# Altium schematic sheet MCU MKL05 QFN24.SchDoc
size A
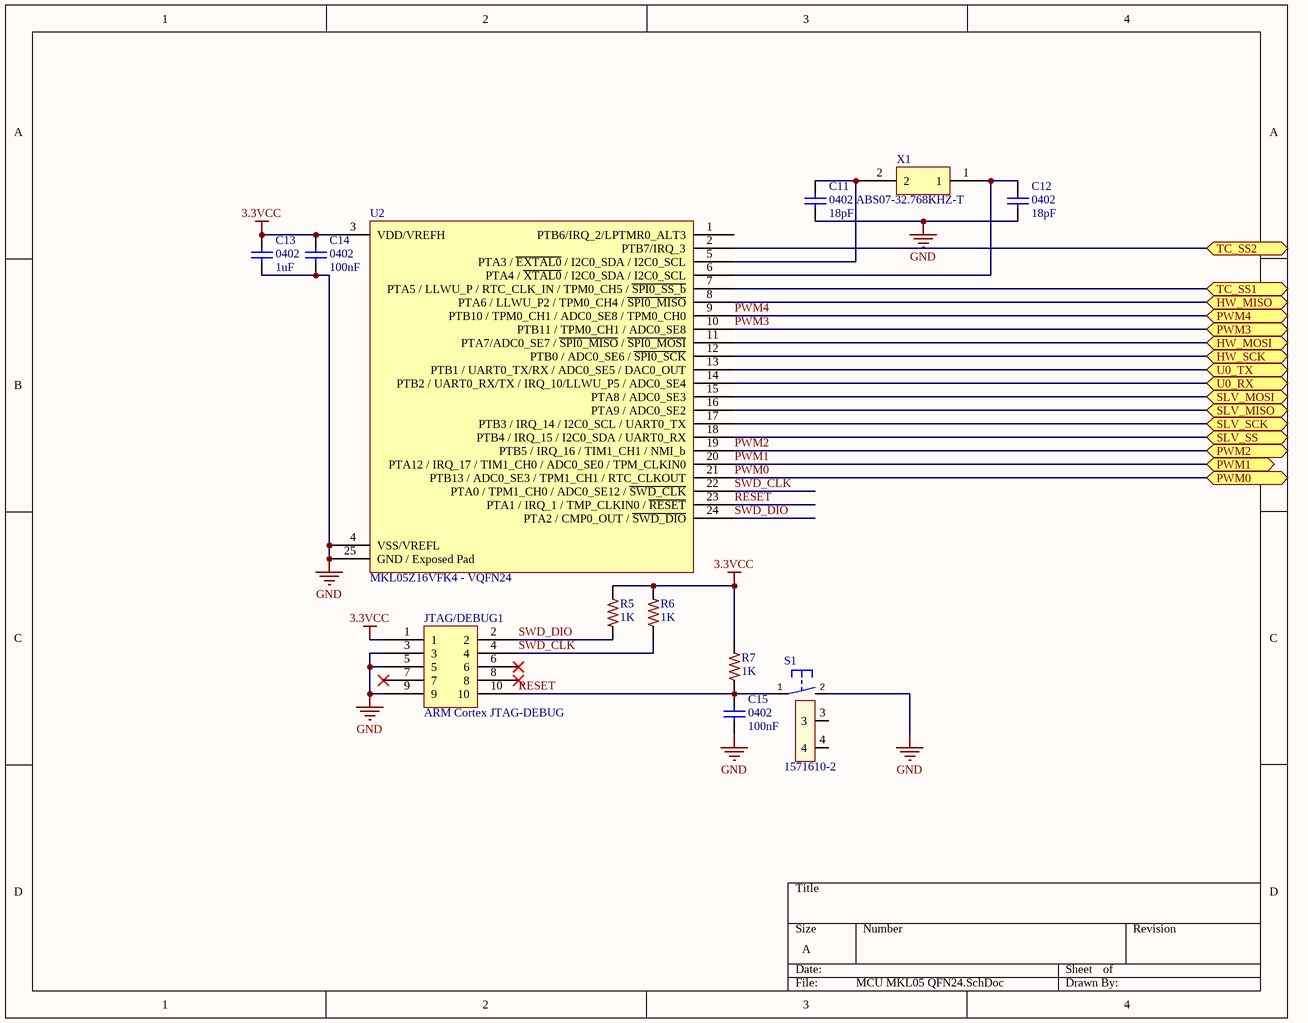
[diagram p0: MCU MKL05 QFN24.SchDoc]

## Parts
C11  value 18pF  [C0402]  (hidden comment: 0402)
C12  value 18pF  [C0402]  (hidden comment: 0402)
C13  value 1uF  [C0402]  (hidden comment: 0402)
C14  value 100nF  [C0402]  (hidden comment: 0402)
C15  value 100nF  [C0402]  (hidden comment: 0402)
JTAG/DEBUG1  ARM Cortex JTAG-DEBUG  [FTSH-105-XX-X-DV]
R5  1K  [R0603]
R6  1K  [R0603]
R7  1K  [R0603]
S1  1571610-2  [B3F-31XX]
U2  MKL05Z16VFK4 - VQFN24  [98ASA00474D]
X1  ABS07-32.768KHZ-T  [ABS07-32.768KHZ-T]

## Ports
HW_MISO, HW_MOSI, HW_SCK, PWM0, PWM1, PWM2, PWM3, PWM4, SLV_MISO, SLV_MOSI, SLV_SCK, SLV_SS, TC_SS1, TC_SS2, U0_RX, U0_TX

## Nets
3.3VCC: C13.2 C14.2 JTAG/DEBUG1.1 R5.1 R6.2 R7.2 U2.3(VDD/VREFH)
GND: C11.1 C12.1 C13.1 C14.1 C15.1 JTAG/DEBUG1.3 JTAG/DEBUG1.5 JTAG/DEBUG1.9 S1.2(S) U2.4(VSS/VREFL) U2.25(GND_/_Exposed_Pad)
HW_MISO: U2.8(PTA6_/_LLWU_P2_/_TPM0_CH4_/_~{SPI0_MISO}) ; port HW_MISO
HW_MOSI: U2.11(PTA7/ADC0_SE7_/_~{SPI0_MISO}_/_~{SPI0_MOSI}) ; port HW_MOSI
HW_SCK: U2.12(PTB0_/_ADC0_SE6_/_~{SPI0_SCK}) ; port HW_SCK
PWM0: U2.21(PTB13_/_ADC0_SE3_/_TPM1_CH1_/_RTC_CLKOUT) ; port PWM0
PWM1: U2.20(PTA12_/_IRQ_17_/_TIM1_CH0_/_ADC0_SE0_/_TPM_CLKIN0) ; port PWM1
PWM2: U2.19(PTB5_/_IRQ_16_/_TIM1_CH1_/_NMI_b) ; port PWM2
PWM3: U2.10(PTB11_/_TPM0_CH1_/_ADC0_SE8) ; port PWM3
PWM4: U2.9(PTB10_/_TPM0_CH1_/_ADC0_SE8_/_TPM0_CH0) ; port PWM4
RESET: C15.2 JTAG/DEBUG1.10 R7.1 S1.1(P) U2.23(PTA1_/_IRQ_1_/_TMP_CLKIN0_/_~{RESET})
SLV_MISO: U2.16(PTA9_/_ADC0_SE2) ; port SLV_MISO
SLV_MOSI: U2.15(PTA8_/_ADC0_SE3) ; port SLV_MOSI
SLV_SCK: U2.17(PTB3_/_IRQ_14_/_I2C0_SCL_/_UART0_TX) ; port SLV_SCK
SLV_SS: U2.18(PTB4_/_IRQ_15_/_I2C0_SDA_/_UART0_RX) ; port SLV_SS
SWD_CLK: JTAG/DEBUG1.4 R6.1 U2.22(PTA0_/_TPM1_CH0_/_ADC0_SE12_/_~{SWD_CLK})
SWD_DIO: JTAG/DEBUG1.2 R5.2 U2.24(PTA2_/_CMP0_OUT_/_~{SWD_DIO})
TC_SS1: U2.7(PTA5_/_LLWU_P_/_RTC_CLK_IN_/_TPM0_CH5_/_~{SPI0_SS_b}) ; port TC_SS1
TC_SS2: U2.2(PTB7/IRQ_3) ; port TC_SS2
U0_RX: U2.14(PTB2_/_UART0_RX/TX_/_IRQ_10/LLWU_P5_/_ADC0_SE4) ; port U0_RX
U0_TX: U2.13(PTB1_/_UART0_TX/RX_/_ADC0_SE5_/_DAC0_OUT) ; port U0_TX
NetC11_2: C11.2 U2.5(PTA3_/_~{EXTAL0}_/_I2C0_SDA_/_I2C0_SCL) X1.2
NetC12_2: C12.2 U2.6(PTA4_/_~{XTAL0}_/_I2C0_SDA_/_I2C0_SCL) X1.1

Not connected (* = marked no-connect by the designer): JTAG/DEBUG1 6* 7* 8*; S1 3 4; U2 1(PTB6/IRQ_2/LPTMR0_ALT3)

## Library data of the parts
C11 C12 = CL05C180GB5NNNC: CAP CER 18PF 50V 2% NP0 0402; Manufacturer: Samsung; Published: 10 - Dec - 2014; LatestRevisionDate: 10 - Dec - 2014; LatestRevisionNote: Ultimachine Footprint Added; Publisher: Ultimachine; Component Type: Chip Capacitor; Manufacture Part #: CL05C180GB5NNNC; Part Description: CAP CER 18PF 50V 2% NP0 0402; Mounting Type: SMT 0402; Datasheet: http://www.samsungsem.com/kr/front/downloadcms.do?path=/kr/support/product-search/mlcc/__icsFiles/afieldfile/2014/11/05&fileName=S_CL05C180GB5NNNC.pdf; Height: 0.25 ± 0.15mm; Tolerance: 2%; Voltage: 50V; PackageReference: 0402
C13 = GRM155R60J105KE19D: CAP CER 1UF 6.3V 10% X5R 0402; MFR: Murata; Voltage: 6.3VDC; Published: 10 - Dec - 2014; LatestRevisionDate: 10 - Dec - 2014; LatestRevisionNote: Ultimachine Footprint Added; Publisher: Ultimachine; Component Type: Chip Capacitor; MFR Part #: GRM155R60J105KE19D; Part Description: CAP CER 1UF 6.3V 10% X5R 0402; Mounting Type: SMT 0402; Datasheet: http://psearch.murata.com/capacitor/product/GRM155R60J105KE19%23.pdf; Height: 0.55mm; Tolerance: 10%; PackageReference: 0402
C14 C15 = GRM155R71C104KA88D: CAP CER 0.1UF (100nF) 16V 10% X7R 0402; MFR: Murata; Part Description: CAP CER 0.1UF 16V 10% X7R 0402; Published: 10 - Dec - 2014; LatestRevisionDate: 10 - Dec - 2014; LatestRevisionNote: Ultimachine Footprint Added; Publisher: Ultimachine; Component Type: Chip Capacitor; MFR Part #: GRM155R71C104KA88D; Mounting Type: SMT 0402; Datasheet: http://psearch.murata.com/capacitor/product/GRM155R71C104KA88%23.pdf; Height: 0.5 ±0.05mm; Tolerance: 10%; Voltage: 16v; PackageReference: 0402
JTAG/DEBUG1 = ARM Cortex JTAG-DEBUG Header
R5-R7 = ERJ-3EKF1001V: RES 0603 1K 100mW 1%; LastRevisionNote: ImportComponents; Published: 23-Apr-2014; Publisher: UltiMachine; LastRevisionDate: 23-Apr-2014; ManufacturerPartNumber: ERJ-3EKF1001V; VALUE: 1K
S1 = 1571610-2_1: SWTCH Momentary Washable; Manufacturer: Omron; Manufacturer: TE; LastRevisionNote: Import; ComponentLink1URL: http://www.te.com/commerce/DocumentDelivery/DDEController?Action=srchrtrv&DocNm=1571610&DocType=Customer+Drawing&DocLang=English; ComponentLink1Description: Datasheet for B3F-31XX; Published: 23-Apr-2014; Publisher: UltiMachine; LastRevisionDate: 23-Apr-2014; ManufacturerPartNumber: 1571610-2; Supplier 1: Mouser; Supplier Part Number 1: 506-1571610-2
U2 = MKL05Z16VFK4 - 24 Pin VQFN: ARM Cortex M0+
X1 = ABS07-32.768KHZ-T: ABS07-32.768KHZ-T RTC Crystal Oscillator